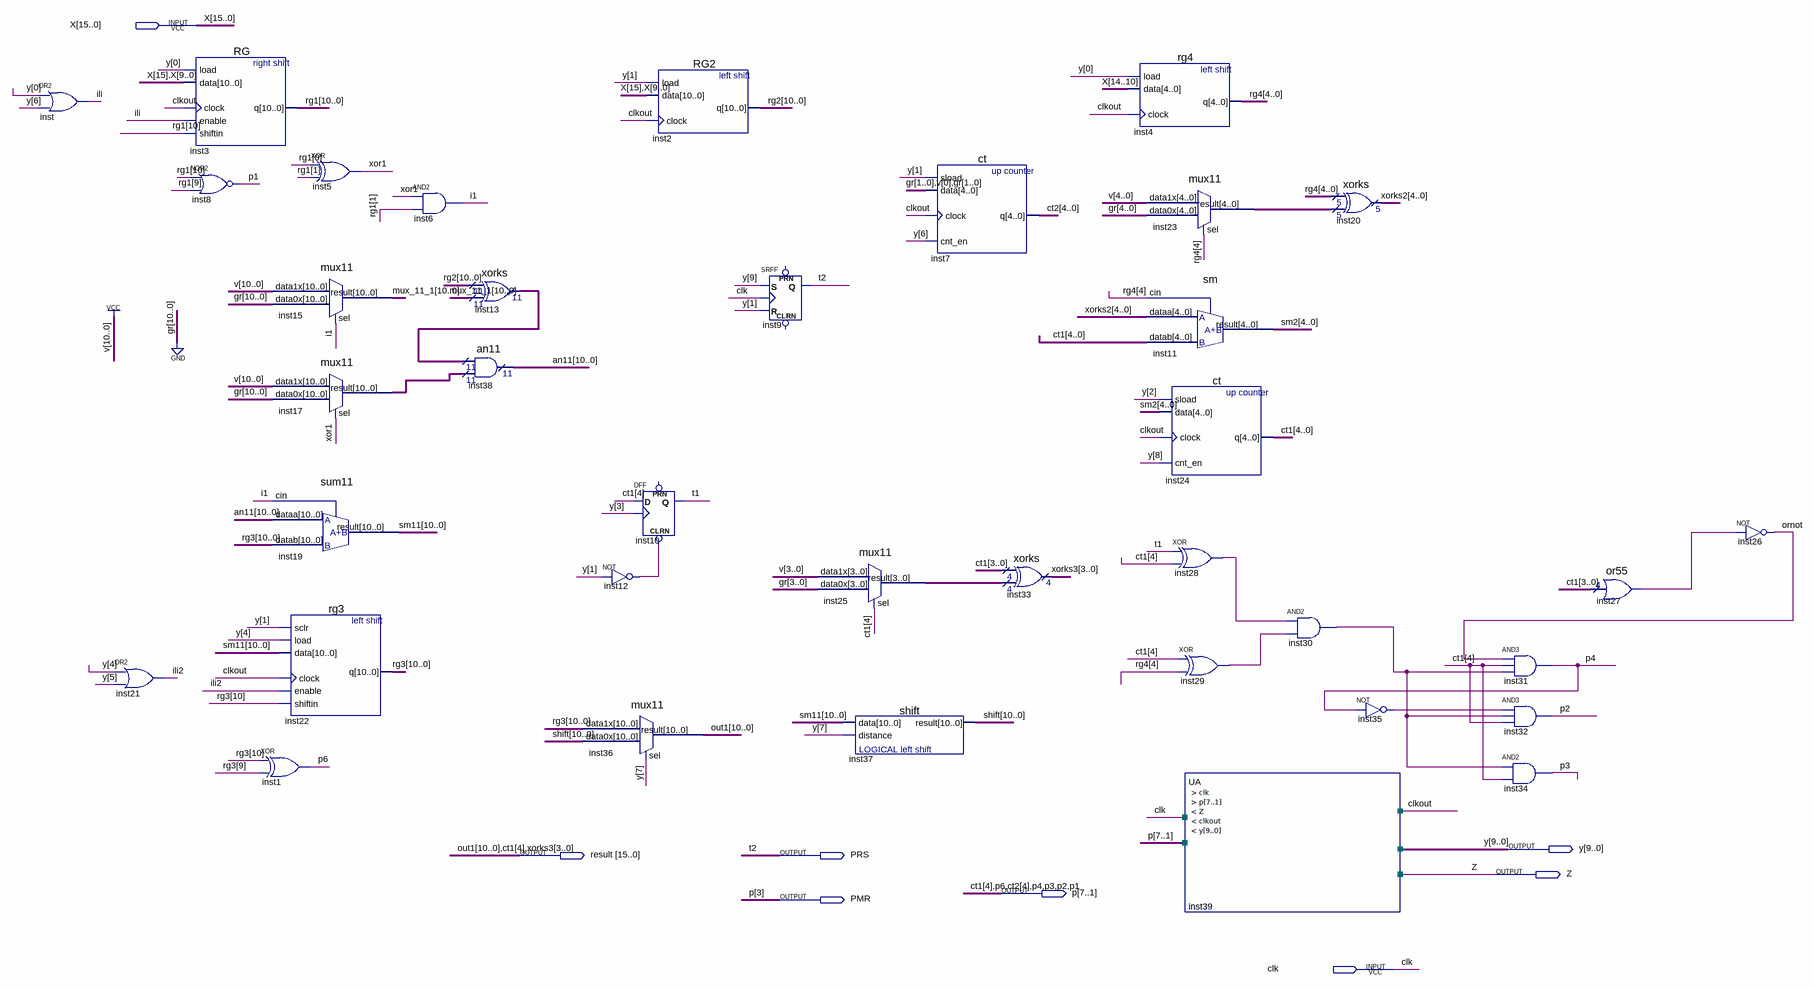
[diagram p0: schematic sheet]
// Quartus schematic laba1.bdf as structural Verilog: 37 symbols, 8 pins
module laba1 (
  input  [15:0] X,
  input  clk,
  output [9:0] y,
  output [15:0] result,
  output PRS,
  output Z,
  output [7:1] p,
  output PMR
);

  wire clkout, i1, ili, ili2, inst12_out, inst27_result, inst28_out, inst29_out, inst30_out, inst35_out,
       ornot, t1, xor1;
  wire [3:0] ct1, ct2, inst25_result;
  wire [4:0] inst23_result, rg4, sm2, xorks2;
  wire [10:0] an11, inst13_result, inst17_result, mux_11_1, rg1, rg2, rg3, shift, sm11;

  or inst (ili, y[0], y[6]);
  or inst21 (ili2, y[4], y[5]);
  RG inst3 (.load(y[0]), .data({X[15], X[9:0]}), .clock(clkout), .enable(ili), .shiftin(rg1[10]), .q(rg1));
  nor inst8 (p[1], rg1[10], rg1[9]);
  xor inst1 (p[6], rg3[10], rg3[9]);
  xor inst5 (xor1, rg1[0], rg1[1]);
  mux11 inst15 (.data1x({11{1'b1}}), .data0x({11{1'b0}}), .sel(i1), .result(mux_11_1));
  mux11 inst17 (.data1x({11{1'b1}}), .data0x({11{1'b0}}), .sel(xor1), .result(inst17_result));
  sum11 inst19 (.dataa(an11), .datab(rg3), .cin(i1), .result(sm11));
  rg3 inst22 (.sclr(y[1]), .load(y[4]), .data(sm11), .clock(clkout), .enable(ili2), .shiftin(rg3[10]), .q(rg3));
  and inst6 (i1, xor1, rg1[1]);
  an11 inst38 (.data0x(inst13_result), .data1x(inst17_result), .result(an11));
  xorks inst13 (.data0x(rg2), .data1x(mux_11_1), .result(inst13_result));
  not inst12 (inst12_out, y[1]);
  mux11 inst36 (.data1x(rg3), .data0x(shift), .sel(y[7]), .result(result[15:5]));
  RG2 inst2 (.load(y[1]), .data({X[15], X[9:0]}), .clock(clkout), .q(rg2));
  DFF inst10 (.CLRN(inst12_out), .CLK(y[3]), .D(p[7]), .Q(t1));  // open: PRN
  SRFF inst9 (.S(y[9]), .R(y[1]), .CLK(clk), .Q(PRS));  // open: PRN, CLRN
  mux11 inst25 (.data1x(4'b1111), .data0x(4'b0000), .sel(p[7]), .result(inst25_result));
  shift inst37 (.data(sm11), .distance(y[7]), .result(shift));
  ct inst7 (.sload(y[1]), .data(5'b00100), .clock(clkout), .cnt_en(y[6]), .q({p[5], ct2}));
  xorks inst33 (.data0x(ct1), .data1x(inst25_result), .result(result[3:0]));
  rg4 inst4 (.load(y[0]), .data(X[14:10]), .clock(clkout), .q(rg4));
  mux11 inst23 (.data1x({5{1'b1}}), .data0x({5{1'b0}}), .sel(rg4[4]), .result(inst23_result));
  sm inst11 (.dataa(xorks2), .datab({p[7], ct1}), .cin(rg4[4]), .result(sm2));
  ct inst24 (.sload(y[2]), .data(sm2), .clock(clkout), .cnt_en(y[8]), .q({p[7], ct1}));
  xor inst28 (inst28_out, t1, p[7]);
  xor inst29 (inst29_out, p[7], rg4[4]);
  UA inst39 (.clk(clk), .p(p), .Z(Z), .clkout(clkout), .y(y));
  and inst30 (inst30_out, inst28_out, inst29_out);
  xorks inst20 (.data0x(rg4), .data1x(inst23_result), .result(xorks2));
  not inst35 (inst35_out, p[4]);
  and inst31 (p[4], ornot, p[7], inst30_out);
  and inst32 (p[2], inst35_out, inst30_out, p[7]);
  and inst34 (p[3], inst30_out, p[7]);
  or55 inst27 (.data(ct1), .result(inst27_result));
  not inst26 (ornot, inst27_result);

  assign PMR = p[3];
  assign result[4] = p[7];

  // Other names for the same wires on the sheet: ct1[4] = p[7]; ct2[4] = p[5]; out1[10:0] = result[15:5]; t2 = PRS;
  //   xorks3[3:0] = result[3:0]
endmodule
